# Altium schematic sheet PE2.SchDoc
size A4
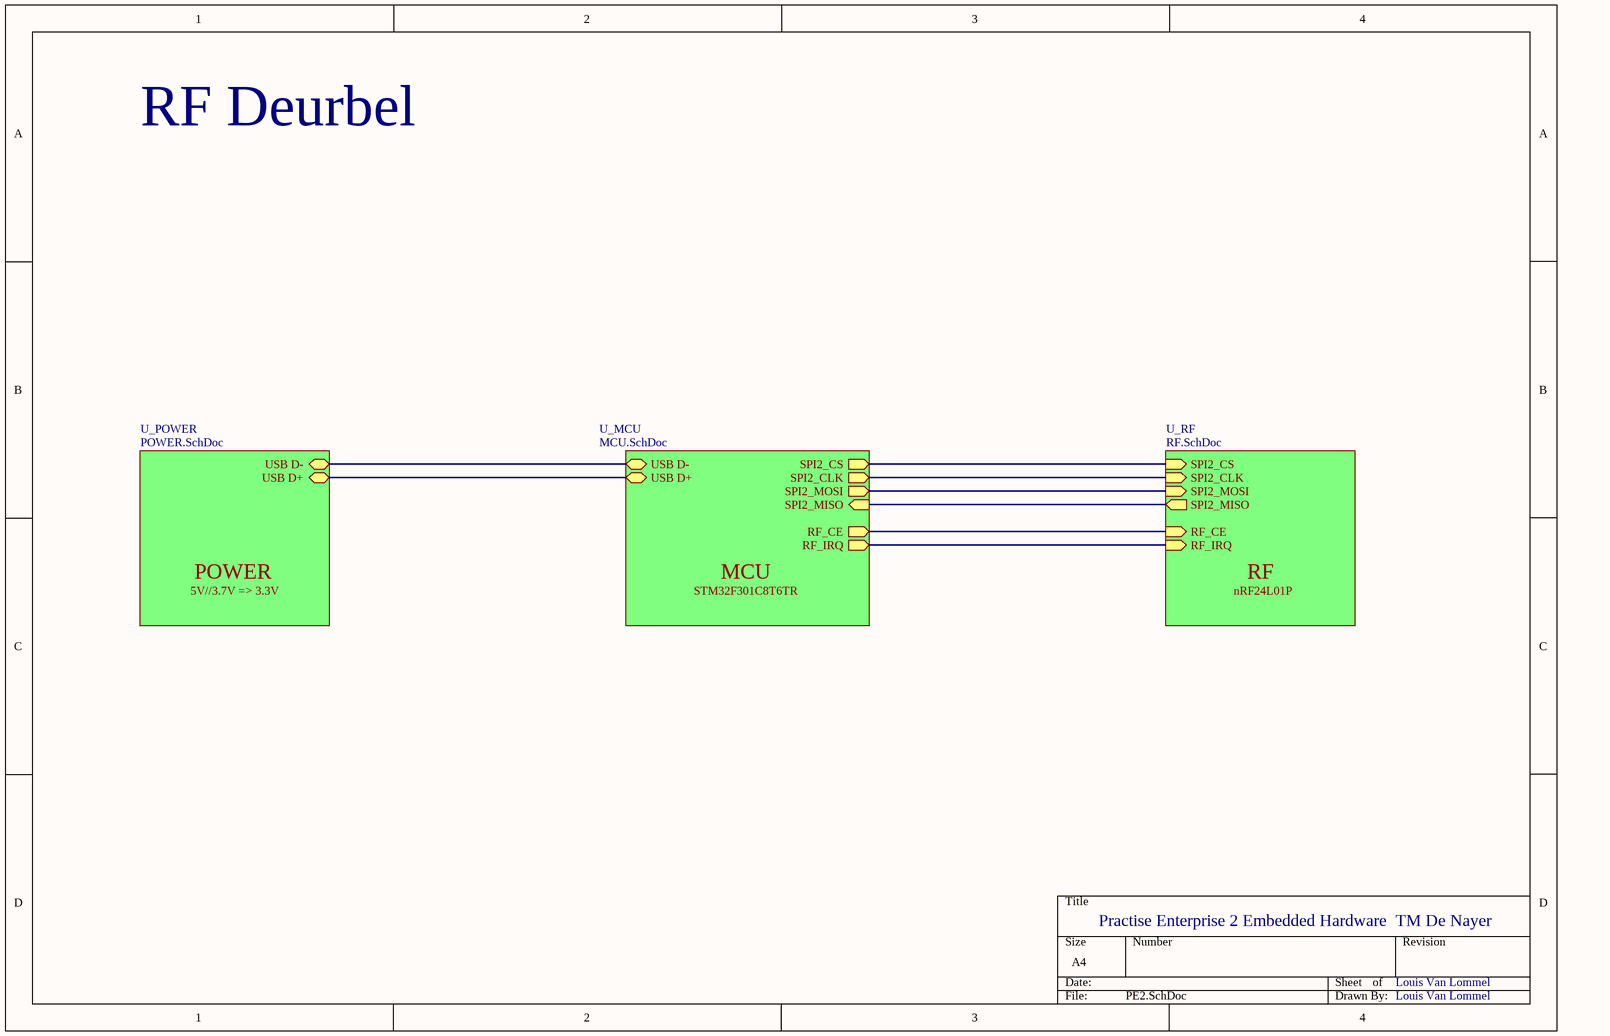
[diagram p0: PE2.SchDoc]

## Sub-sheets
U_MCU = MCU.SchDoc: USB D+ (bidir), USB D- (bidir), SPI2_CS (out), SPI2_CLK (out), SPI2_MISO (in), SPI2_MOSI (out), RF_CE (out), RF_IRQ (out)
U_POWER = POWER.SchDoc: USB D+ (bidir), USB D- (bidir)
U_RF = RF.SchDoc: SPI2_MOSI (in), SPI2_MISO (out), SPI2_CLK (in), SPI2_CS (in), RF_CE (in), RF_IRQ (in)

## Nets
(unnamed): sheet U_POWER/USB D+, sheet U_MCU/USB D+
(unnamed): sheet U_POWER/USB D-, sheet U_MCU/USB D-
(unnamed): sheet U_RF/SPI2_MOSI, sheet U_MCU/SPI2_MOSI
(unnamed): sheet U_RF/SPI2_MISO, sheet U_MCU/SPI2_MISO
(unnamed): sheet U_RF/SPI2_CLK, sheet U_MCU/SPI2_CLK
(unnamed): sheet U_RF/SPI2_CS, sheet U_MCU/SPI2_CS
(unnamed): sheet U_RF/RF_CE, sheet U_MCU/RF_CE
(unnamed): sheet U_RF/RF_IRQ, sheet U_MCU/RF_IRQ

## Notes on the sheet
- RF Deurbel
- POWER
- MCU
- RF
- 5V//3.7V => 3.3V
- STM32F301C8T6TR
- nRF24L01P
- Practise Enterprise 2 Embedded Hardware  TM De Nayer
- Louis Van Lommel